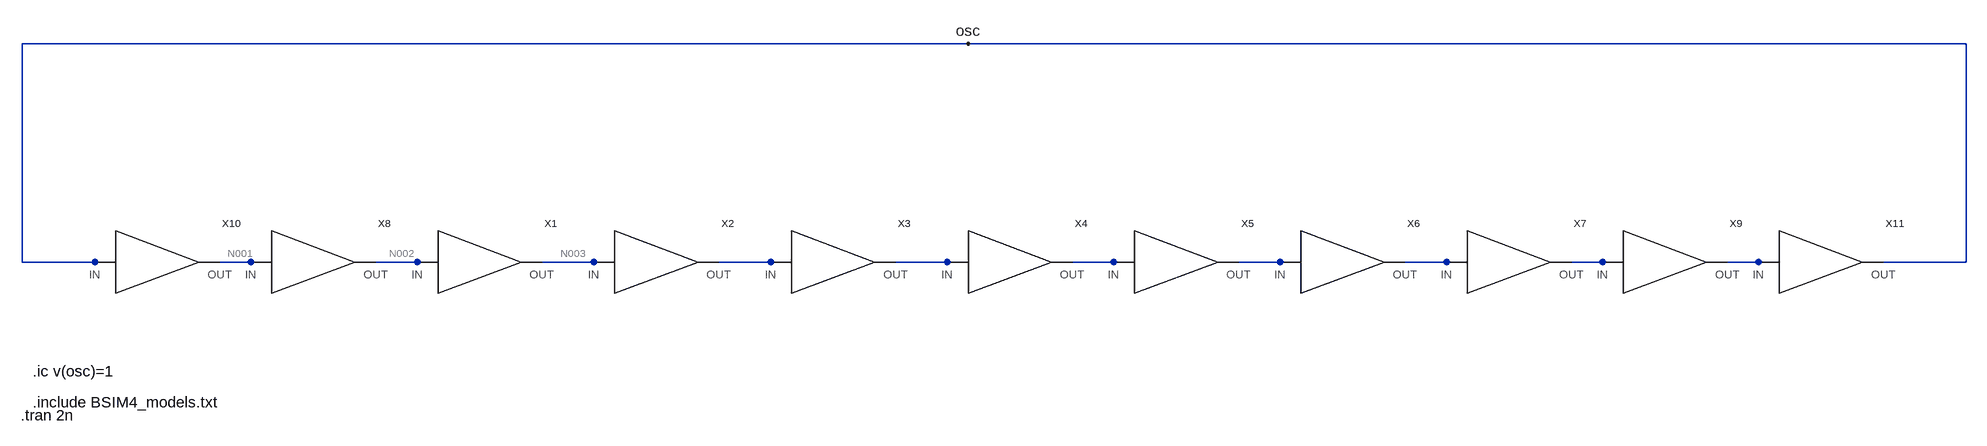
[diagram p0: schematic Ring_Oscillator.asc]
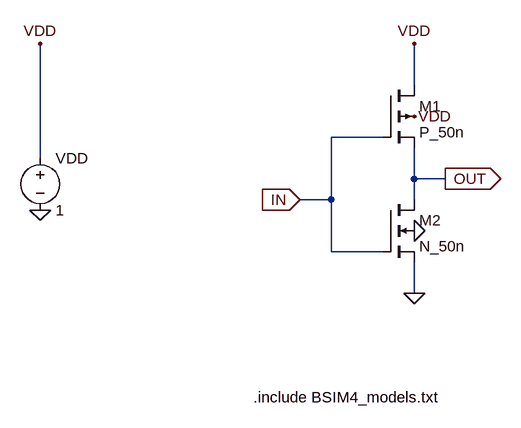
[diagram p1: sub-circuit cmos_symbol.asc]
Ring_Oscillator.asc, the LTspice schematic file:
Version 4
SHEET 1 2100 680
WIRE 560 -80 -896 -80
WIRE 2096 -80 560 -80
WIRE -896 256 -896 -80
WIRE -768 256 -896 256
WIRE -528 256 -592 256
WIRE -272 256 -352 256
WIRE 0 256 -96 256
WIRE 272 256 176 256
WIRE 544 256 448 256
WIRE 800 256 720 256
WIRE 1056 256 976 256
WIRE 1312 256 1232 256
WIRE 1552 256 1488 256
WIRE 1792 256 1728 256
WIRE 2096 256 2096 -80
WIRE 2096 256 1968 256
FLAG 560 -80 osc
SYMBOL cmos_symbol -176 256 R0
SYMATTR InstName X1
SYMBOL cmos_symbol 96 256 R0
SYMATTR InstName X2
SYMBOL cmos_symbol 368 256 R0
SYMATTR InstName X3
SYMBOL cmos_symbol 640 256 R0
SYMATTR InstName X4
SYMBOL cmos_symbol 896 256 R0
SYMATTR InstName X5
SYMBOL cmos_symbol 1152 256 R0
SYMATTR InstName X6
SYMBOL cmos_symbol 1408 256 R0
SYMATTR InstName X7
SYMBOL cmos_symbol -432 256 R0
SYMATTR InstName X8
SYMBOL cmos_symbol 1648 256 R0
SYMATTR InstName X9
SYMBOL cmos_symbol -672 256 R0
SYMATTR InstName X10
SYMBOL cmos_symbol 1888 256 R0
SYMATTR InstName X11
TEXT -880 424 Left 2 !.ic v(osc)=1
TEXT -880 472 Left 2 !.include BSIM4_models.txt
TEXT -898 492 Left 2 !.tran 2n

cmos_symbol.asc, the sub-circuit schematic file:
Version 4
SHEET 1 880 848
WIRE 400 352 400 288
WIRE 352 432 272 432
WIRE -176 464 -176 288
WIRE 400 496 400 448
WIRE 448 496 400 496
WIRE 272 528 272 432
WIRE 272 528 224 528
WIRE 400 528 400 496
WIRE 272 608 272 528
WIRE 352 608 272 608
WIRE 400 672 400 624
FLAG -176 544 0
FLAG 224 528 IN
IOPIN 224 528 In
FLAG 448 496 OUT
IOPIN 448 496 Out
FLAG -176 288 VDD
FLAG 400 400 VDD
FLAG 400 288 VDD
FLAG 400 672 0
FLAG 400 576 0
SYMBOL pmos4 352 352 R0
SYMATTR InstName M1
SYMATTR Value P_50n
SYMATTR Value2 l=50n w=1u
SYMBOL nmos4 352 528 R0
SYMATTR InstName M2
SYMATTR Value N_50n
SYMATTR Value2 l=50n w=500n
SYMBOL voltage -176 448 R0
SYMATTR InstName VDD
SYMATTR Value 1
TEXT 152 832 Left 2 !.include BSIM4_models.txt

The netlist it stands for:
* Ring_Oscillator.asc
XX1 N002 N003 cmos_symbol
XX2 N003 N004 cmos_symbol
XX3 N004 N005 cmos_symbol
XX4 N005 N006 cmos_symbol
XX5 N006 N007 cmos_symbol
XX6 N007 N008 cmos_symbol
XX7 N008 N009 cmos_symbol
XX8 N001 N002 cmos_symbol
XX9 N009 N010 cmos_symbol
XX10 osc N001 cmos_symbol
XX11 N010 osc cmos_symbol

* block symbol definitions
.subckt cmos_symbol IN OUT
M1 VDD IN OUT VDD P_50n l=50n w=1u
M2 OUT IN 0 0 N_50n l=50n w=500n
VDD VDD 0 1
.include BSIM4_models.txt
.ends cmos_symbol

.model NMOS NMOS
.model PMOS PMOS
.lib standard.mos
.ic v(osc)=1
.include BSIM4_models.txt
.tran 2n
.backanno
.end

* Results of the author's LTspice run, read from the files saved beside the schematic
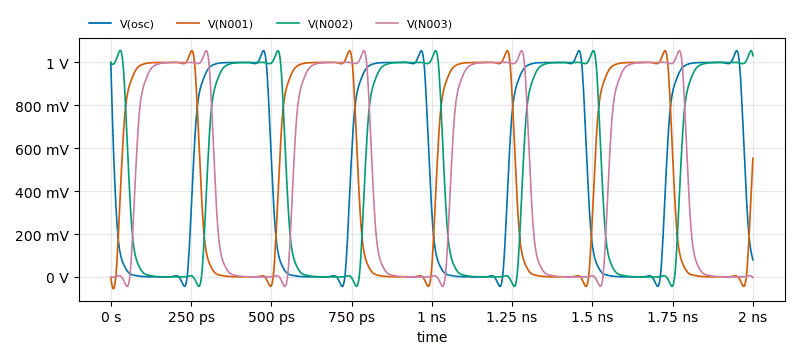
[diagram p2: Transient Analysis of Ring_Oscillator.asc, plotted from the saved traces]
* Transient Analysis, 1 run:
*   V(osc): min -44.42 mV, max 1.055 V, average 495.5 mV, rms 679.6 mV, last 79.98 mV
*   V(N001): min -55.46 mV, max 1.055 V, average 491.2 mV, rms 677.6 mV, last 553.2 mV
*   V(N002): min -44.35 mV, max 1.056 V, average 506.8 mV, rms 690.2 mV, last 1.032 V
*   V(N003): min -44.55 mV, max 1.055 V, average 489 mV, rms 676.9 mV, last -2.873 mV